# Altium schematic sheet MIS_Locker.SchDoc: MIS Locker Schematic
size A; Date: 27/10/2019; DrawnBy: Minh-An Dao; Organization: Can Tho University; Revision: 1.0; SheetNumber: 1; SheetTotal: 10
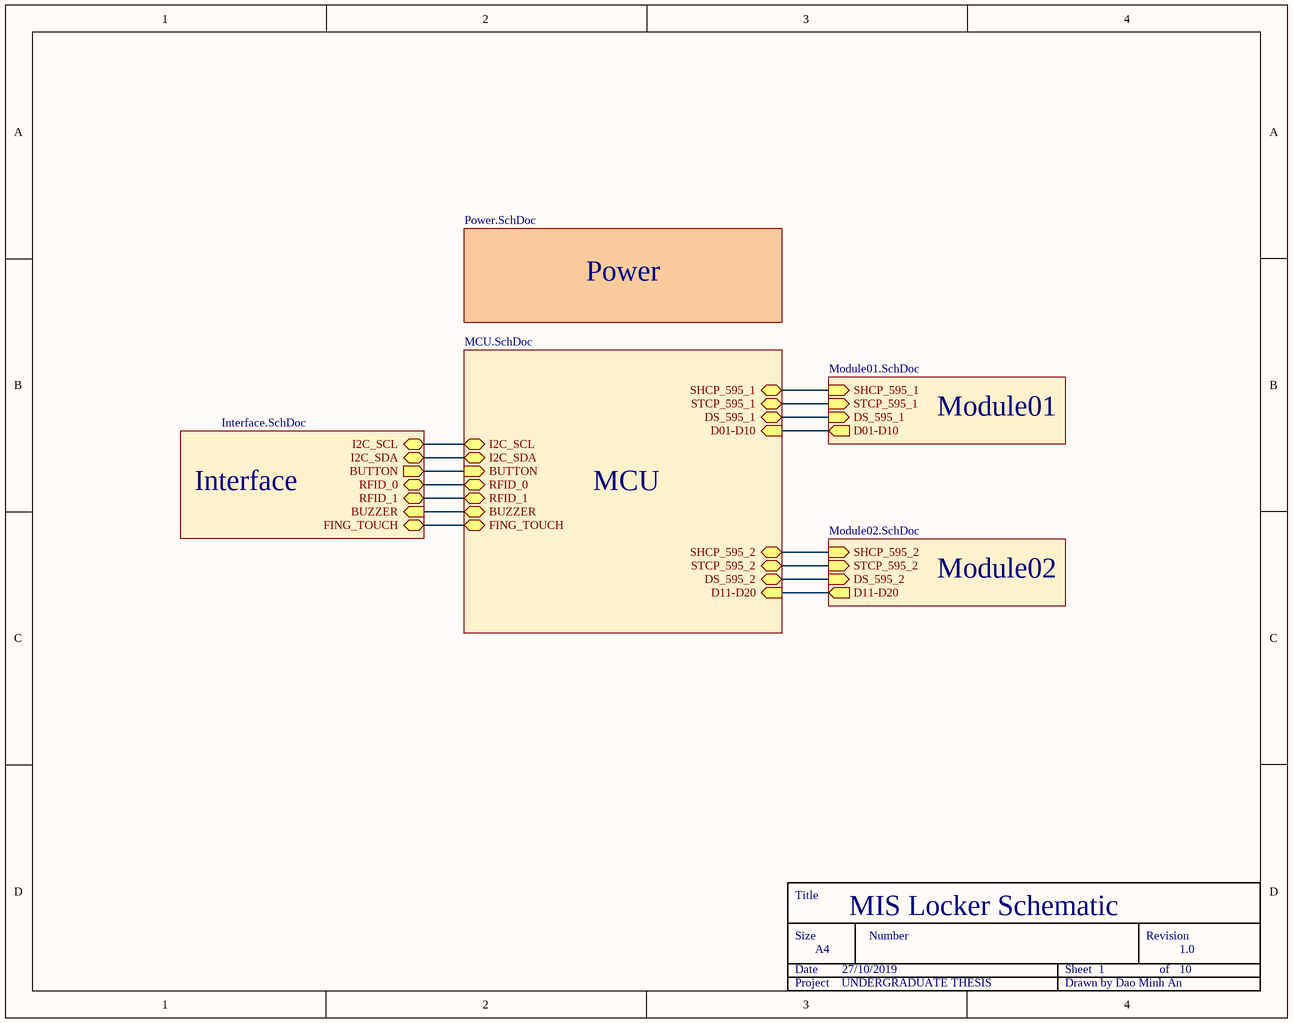
[diagram p0: MIS_Locker.SchDoc]

## Parts
T1  Title_Block  (value not drawn)

## Sub-sheets
Interface = Interface.SchDoc: BUTTON (out), I2C_SCL (bidir), I2C_SDA (bidir), RFID_0 (bidir), RFID_1 (bidir), BUZZER (in), FING_TOUCH (bidir)
MCU = MCU.SchDoc: DS_595_2 (bidir), STCP_595_2 (bidir), SHCP_595_2 (bidir), DS_595_1 (bidir), STCP_595_1 (bidir), SHCP_595_1 (bidir), I2C_SCL (bidir), I2C_SDA (bidir), D01-D10 (in), D11-D20 (in), BUTTON (in), BUZZER (bidir), RFID_0 (bidir), RFID_1 (bidir), FING_TOUCH (bidir)
Module01 = Module01.SchDoc: SHCP_595_1 (in), STCP_595_1 (in), DS_595_1 (in), D01-D10 (out)
Module02 = Module02.SchDoc: SHCP_595_2 (in), STCP_595_2 (in), DS_595_2 (in), D11-D20 (out)
Power = Power.SchDoc: no entries

## Nets
(unnamed): sheet Module01/SHCP_595_1, sheet MCU/SHCP_595_1
(unnamed): sheet Module01/STCP_595_1, sheet MCU/STCP_595_1
(unnamed): sheet Module01/DS_595_1, sheet MCU/DS_595_1
(unnamed): sheet Module01/D01-D10, sheet MCU/D01-D10
(unnamed): sheet Module02/SHCP_595_2, sheet MCU/SHCP_595_2
(unnamed): sheet Module02/STCP_595_2, sheet MCU/STCP_595_2
(unnamed): sheet Module02/DS_595_2, sheet MCU/DS_595_2
(unnamed): sheet Module02/D11-D20, sheet MCU/D11-D20
(unnamed): sheet MCU/I2C_SCL, sheet Interface/I2C_SCL
(unnamed): sheet MCU/I2C_SDA, sheet Interface/I2C_SDA
(unnamed): sheet MCU/BUTTON, sheet Interface/BUTTON
(unnamed): sheet MCU/BUZZER, sheet Interface/BUZZER
(unnamed): sheet MCU/RFID_0, sheet Interface/RFID_0
(unnamed): sheet MCU/RFID_1, sheet Interface/RFID_1
(unnamed): sheet MCU/FING_TOUCH, sheet Interface/FING_TOUCH

## Notes on the sheet
- (in symbol Title_Block) Title; Size; Number; Revision; A4; Date; Sheet; of; Project    UNDERGRADUATE THESIS; Drawn by Dao Minh An